# Altium project 7841R_IDC_RS50_DIO.PrjPcb
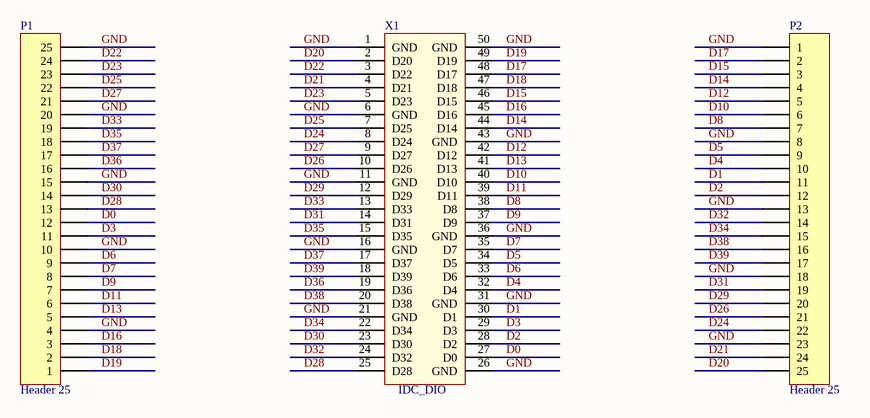
[diagram p0: IDC_RS50_DIO_Sheet1.SchDoc]
1 sheet, 3 parts. Net scope: global (net labels, ports and power ports of the same name join across sheets).
Board file: IDC_RS50_DIO.PcbDoc

## Sheet IDC_RS50_DIO_Sheet1.SchDoc
size A3; SheetNumber: 1; SheetTotal: 1

### Parts
P1  Header 25  [HDR1X25]
P2  Header 25  [HDR1X25]
X1  IDC_DIO  [IDC_DIO]

### Nets
D0: P1.12 X1.27(D0)
D1: P2.11 X1.30(D1)
D2: P2.12 X1.28(D2)
D3: P1.11 X1.29(D3)
D4: P2.10 X1.32(D4)
D5: P2.9 X1.34(D5)
D6: P1.9 X1.33(D6)
D7: P1.8 X1.35(D7)
D8: P2.7 X1.38(D8)
D9: P1.7 X1.37(D9)
D10: P2.6 X1.40(D10)
D11: P1.6 X1.39(D11)
D12: P2.5 X1.42(D12)
D13: P1.5 X1.41(D13)
D14: P2.4 X1.44(D14)
D15: P2.3 X1.46(D15)
D16: P1.3 X1.45(D16)
D17: P2.2 X1.48(D17)
D18: P1.2 X1.47(D18)
D19: P1.1 X1.49(D19)
D20: P2.25 X1.2(D20)
D21: P2.24 X1.4(D21)
D22: P1.24 X1.3(D22)
D23: P1.23 X1.5(D23)
D24: P2.22 X1.8(D24)
D25: P1.22 X1.7(D25)
D26: P2.21 X1.10(D26)
D27: P1.21 X1.9(D27)
D28: P1.13 X1.25(D28)
D29: P2.20 X1.12(D29)
D30: P1.14 X1.23(D30)
D31: P2.19 X1.14(D31)
D32: P2.14 X1.24(D32)
D33: P1.19 X1.13(D33)
D34: P2.15 X1.22(D34)
D35: P1.18 X1.15(D35)
D36: P1.16 X1.19(D36)
D37: P1.17 X1.17(D37)
D38: P2.16 X1.20(D38)
D39: P2.17 X1.18(D39)
GND: P1.4 P1.10 P1.15 P1.20 P1.25 P2.1 P2.8 P2.13 P2.18 P2.23 X1.1(GND) X1.6(GND) X1.11(GND) X1.16(GND) X1.21(GND) X1.26(GND) X1.31(GND) X1.36(GND) X1.43(GND) X1.50(GND)

### Library data of the parts
P1 P2 = Header 25: Header, 25-Pin; LatestRevisionDate: 17-Jul-2002; LatestRevisionNote: Re-released for DXP Platform.; Publisher: Altium Limited